# Altium schematic sheet MCU.SchDoc
size A3
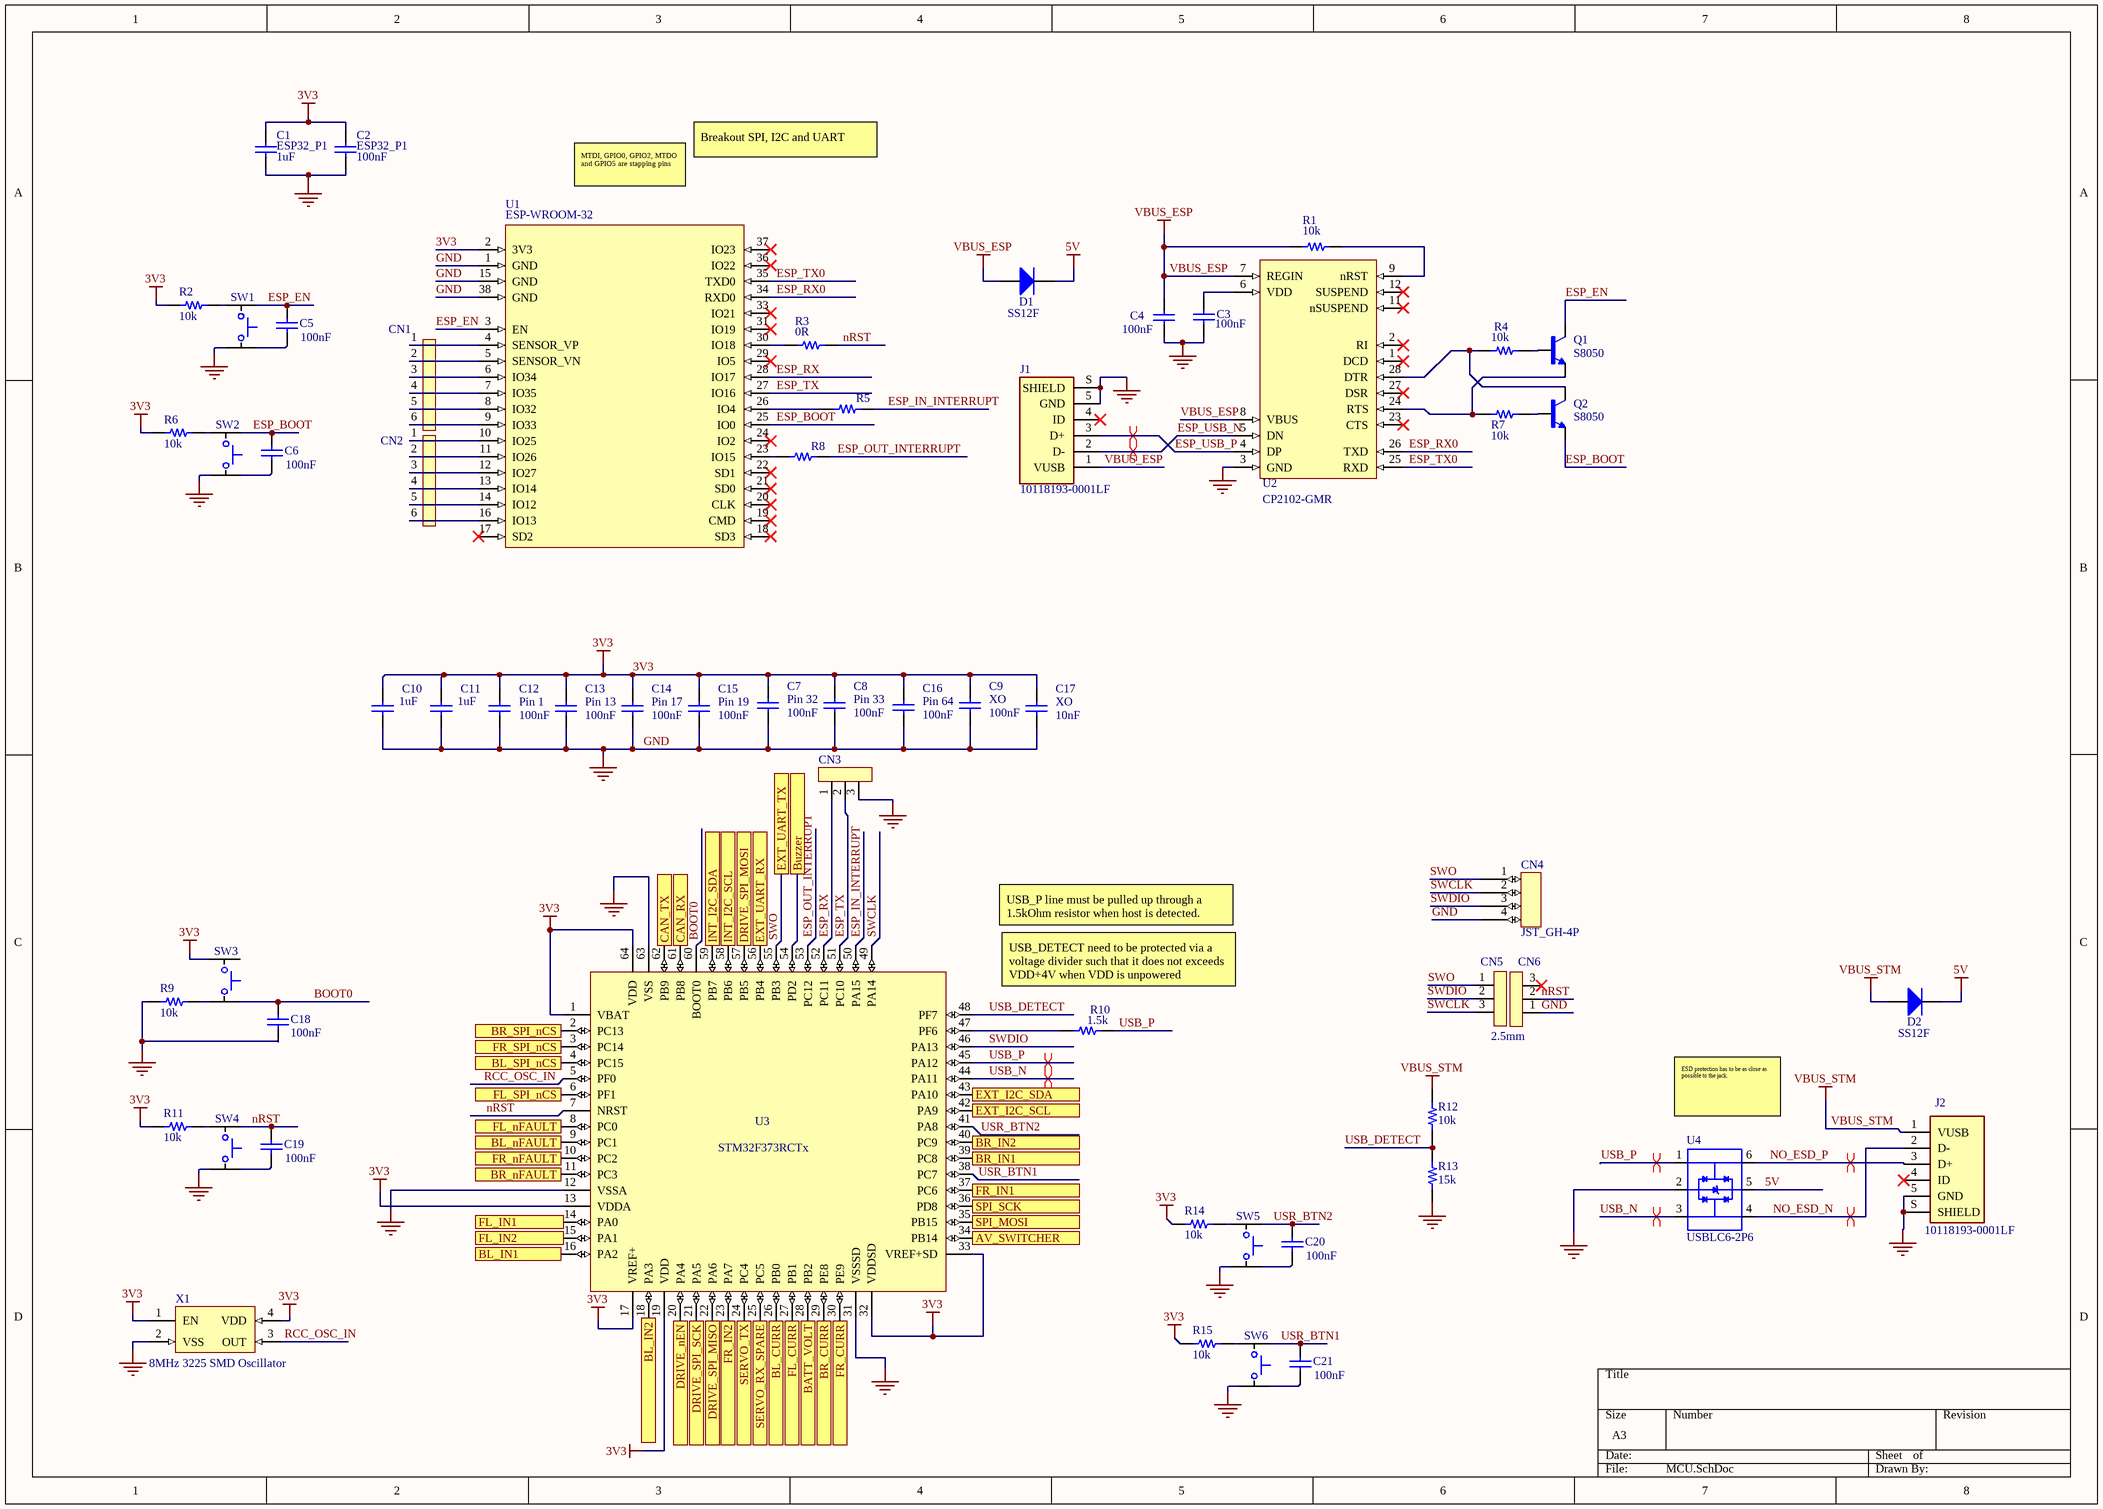
[diagram p0: MCU.SchDoc]

## Parts
C1  ESP32_P1  value 1uF  [0402]
C2  ESP32_P1  value 100nF  [0402]
C3  value 100nF  [0402]  (hidden comment: P6)
C4  value 100nF  [0402]  (hidden comment: P7)
C5  value 100nF  [0402]  (hidden comment: Cap)
C6  value 100nF  [0402]  (hidden comment: Cap)
C7  Pin 32  value 100nF  [0402]
C8  Pin 33  value 100nF  [0402]
C9  XO  value 100nF  [0402]
C10  value 1uF  [0402]
C11  value 1uF  [0402]
C12  Pin 1  value 100nF  [0402]
C13  Pin 13  value 100nF  [0402]
C14  Pin 17  value 100nF  [0402]
C15  Pin 19  value 100nF  [0402]
C16  Pin 64  value 100nF  [0402]
C17  XO  value 10nF  [0402]
C18  value 100nF  [0402]  (hidden comment: Cap)
C19  value 100nF  [0402]  (hidden comment: Cap)
C20  value 100nF  [0402]  (hidden comment: Cap)
C21  value 100nF  [0402]  (hidden comment: Cap)
CN1  6P-2.5mm  [6-Pin-Header]  (value not drawn)
CN2  6P-2.5mm  [6-Pin-Header]  (value not drawn)
CN3  3P-2.5mm  [2.5mm-3P]  (value not drawn)
CN4  JST_GH-4P  [JST_GH-4P]
CN5  2.5mm  [2.5mm-3P]
CN6  3P-2.5mm  [2.5mm-3P]  (value not drawn)
D1  SS12F  [SMAF_DIODE]
D2  SS12F  [SMAF_DIODE]
J1  10118193-0001LF  [FCI_10118193-0001LF]
J2  10118193-0001LF  [FCI_10118193-0001LF]
Q1  S8050  [SOT23-FET]
Q2  S8050  [SOT23-FET]
R1  10k  [0805 - duplicate]
R2  10k  [0805 - duplicate]
R3  0R  [0805 - duplicate]
R4  10k  [0805 - duplicate]
R5  1k  [0805 - duplicate]  (value not drawn)
R6  10k  [0805 - duplicate]
R7  10k  [0805 - duplicate]
R8  1k  [0805 - duplicate]  (value not drawn)
R9  10k  [0805 - duplicate]
R10  1.5k  [0805 - duplicate]
R11  10k  [0805 - duplicate]
R12  10k  [2010_SMD_Resistor]
R13  15k  [2010_SMD_Resistor]
R14  10k  [0805 - duplicate]
R15  10k  [0805 - duplicate]
SW1  SPST Switch  [4.8x4.8-SMD-SWITCH]  (value not drawn)
SW2  SPST Switch  [4.8x4.8-SMD-SWITCH]  (value not drawn)
SW3  SPST Switch  [4.8x4.8-SMD-SWITCH]  (value not drawn)
SW4  SPST Switch  [4.8x4.8-SMD-SWITCH]  (value not drawn)
SW5  USR_BTN2  [4.8x4.8-SMD-SWITCH]  (value not drawn)
SW6  USR_BTN1  [4.8x4.8-SMD-SWITCH]  (value not drawn)
U1  ESP-WROOM-32  [ESP-WROOM-32]
U2  CP2102-GMR  [QFN28G_0.5-5X5MM]
U3  STM32F373RCTx  [LQFP64]
U4  USBLC6-2P6  [SOT50P160X60-6N]
X1  8MHz 3225 SMD Oscillator  [3.2x2.5 SMD]

## Ports
AV_SWITCHER, BATT_VOLT, BL_CURR, BL_IN1, BL_IN2, BL_nFAULT, BL_SPI_nCS, BR_CURR, BR_IN1, BR_IN2, BR_nFAULT, BR_SPI_nCS, Buzzer, CAN_RX, CAN_TX, DRIVE_nEN, DRIVE_SPI_MISO, DRIVE_SPI_MOSI, DRIVE_SPI_SCK, EXT_I2C_SCL, EXT_I2C_SDA, EXT_UART_RX, EXT_UART_TX, FL_CURR, FL_IN1, FL_IN2, FL_nFAULT, FL_SPI_nCS, FR_CURR, FR_IN1, FR_IN2, FR_nFAULT, FR_SPI_nCS, INT_I2C_SCL, INT_I2C_SDA, SERVO_RX_SPARE, SERVO_TX, SPI_MOSI, SPI_SCK

## Nets
3V3: C1.2 C2.2 C7.2 C8.2 C9.2 C10.2 C11.2 C12.2 C13.2 C14.2 C15.2 C16.2 C17.2 R2.1 R6.1 R11.1 R14.1 R15.1 SW3.1 U1.2(3V3) U3.1(VBAT) U3.13(VDDA) U3.17(VREF+) U3.19(VDD) U3.32(VDDSD) U3.33(VREF+SD) U3.64(VDD) X1.1(EN) X1.4(VDD)
5V: D1.2(K) D2.2(K) U4.5(VBUS)
GND: C1.1 C2.1 C3.1 C4.1 C7.1 C8.1 C9.1 C10.1 C11.1 C12.1 C13.1 C14.1 C15.1 C16.1 C17.1 C18.2 CN3.3 CN4.4 CN6.1 J1.5(GND) J1.S(SHIELD) J2.5(GND) J2.S(SHIELD) R9.1 R13.1 SW1.3 SW2.3 SW4.3 SW5.3 SW6.3 U1.1(GND) U1.15(GND) U1.38(GND) U2.3(GND) U3.12(VSSA) U3.31(VSSSD) U3.63(VSS) U4.2(GND) X1.2(VSS)
VBUS_ESP: C4.2 D1.1(A) J1.1(VUSB) R1.1 U2.7(REGIN) U2.8(VBUS)
VBUS_STM: D2.1(A) J2.1(VUSB) R12.2
AV_SWITCHER: U3.34(PB14) ; port AV_SWITCHER
BATT_VOLT: U3.28(PB2) ; port BATT_VOLT
BL_CURR: U3.26(PB0) ; port BL_CURR
BL_IN1: U3.16(PA2) ; port BL_IN1
BL_IN2: U3.18(PA3) ; port BL_IN2
BL_nFAULT: U3.9(PC1) ; port BL_nFAULT
BL_SPI_nCS: U3.4(PC15) ; port BL_SPI_nCS
BOOT0: C18.1 SW3.4 U3.60(BOOT0)
BR_CURR: U3.29(PE8) ; port BR_CURR
BR_IN1: U3.39(PC8) ; port BR_IN1
BR_IN2: U3.40(PC9) ; port BR_IN2
BR_nFAULT: U3.11(PC3) ; port BR_nFAULT
BR_SPI_nCS: U3.2(PC13) ; port BR_SPI_nCS
Buzzer: U3.54(PD2) ; port Buzzer
CAN_RX: U3.61(PB8) ; port CAN_RX
CAN_TX: U3.62(PB9) ; port CAN_TX
DRIVE_nEN: U3.20(PA4) ; port DRIVE_nEN
DRIVE_SPI_MISO: U3.22(PA6) ; port DRIVE_SPI_MISO
DRIVE_SPI_MOSI: U3.57(PB5) ; port DRIVE_SPI_MOSI
DRIVE_SPI_SCK: U3.21(PA5) ; port DRIVE_SPI_SCK
ESP_BOOT: C6.2 Q2.2(E) SW2.2 U1.25(IO0)
ESP_EN: C5.2 Q1.3(C) SW1.2 U1.3(EN)
ESP_IN_INTERRUPT: R5.2 U3.50(PA15)
ESP_OUT_INTERRUPT: R8.2 U3.53(PC12)
ESP_RX: CN3.1 U1.28(IO17) U3.52(PC11)
ESP_RX0: U1.34(RXD0) U2.26(TXD)
ESP_TX: CN3.2 U1.27(IO16) U3.51(PC10)
ESP_TX0: U1.35(TXD0) U2.25(RXD)
ESP_USB_N: J1.2(D-) U2.5(DN)
ESP_USB_P: J1.3(D+) U2.4(DP)
EXT_I2C_SCL: U3.42(PA9) ; port EXT_I2C_SCL
EXT_I2C_SDA: U3.43(PA10) ; port EXT_I2C_SDA
EXT_UART_RX: U3.56(PB4) ; port EXT_UART_RX
FL_CURR: U3.27(PB1) ; port FL_CURR
FL_IN1: U3.14(PA0) ; port FL_IN1
FL_IN2: U3.15(PA1) ; port FL_IN2
FL_nFAULT: U3.8(PC0) ; port FL_nFAULT
FL_SPI_nCS: U3.6(PF1) ; port FL_SPI_nCS
FR_CURR: U3.30(PE9) ; port FR_CURR
FR_IN1: U3.37(PC6) ; port FR_IN1
FR_IN2: U3.23(PA7) ; port FR_IN2
FR_nFAULT: U3.10(PC2) ; port FR_nFAULT
FR_SPI_nCS: U3.3(PC14) ; port FR_SPI_nCS
INT_I2C_SCL: U3.58(PB6) ; port INT_I2C_SCL
INT_I2C_SDA: U3.59(PB7) ; port INT_I2C_SDA
NO_ESD_N: J2.2(D-) U4.4(I/O2_2)
NO_ESD_P: J2.3(D+) U4.6(I/O1_2)
nRST: C19.2 CN6.2 R3.2 SW4.2 U3.7(NRST)
RCC_OSC_IN: U3.5(PF0) X1.3(OUT)
SERVO_RX_SPARE: U3.25(PC5) ; port SERVO_RX_SPARE
SERVO_TX: U3.24(PC4) ; port SERVO_TX
SPI_MOSI: U3.35(PB15) ; port SPI_MOSI
SPI_SCK: U3.36(PD8) ; port SPI_SCK
SWCLK: CN4.2 CN5.3 U3.49(PA14)
SWDIO: CN4.3 CN5.2 U3.46(PA13)
SWO: CN4.1 CN5.1 U3.55(PB3) ; port EXT_UART_TX
USB_DETECT: R12.1 R13.2 U3.48(PF7)
USB_N: U3.44(PA11) U4.3(I/O2_1)
USB_P: R10.2 U3.45(PA12) U4.1(I/O1_1)
USR_BTN1: C21.2 SW6.2 U3.38(PC7)
USR_BTN2: C20.2 SW5.2 U3.41(PA8)
NetC3_2: C3.2 U2.6(VDD)
NetC5_1: C5.1 SW1.4
NetC6_1: C6.1 SW2.4
NetC19_1: C19.1 SW4.4
NetC20_1: C20.1 SW5.4
NetC21_1: C21.1 SW6.4
NetCN1_1: CN1.1 U1.4(SENSOR_VP)
NetCN1_2: CN1.2 U1.5(SENSOR_VN)
NetCN1_3: CN1.3 U1.6(IO34)
NetCN1_4: CN1.4 U1.7(IO35)
NetCN1_5: CN1.5 U1.8(IO32)
NetCN1_6: CN1.6 U1.9(IO33)
NetCN2_1: CN2.1 U1.10(IO25)
NetCN2_2: CN2.2 U1.11(IO26)
NetCN2_3: CN2.3 U1.12(IO27)
NetCN2_4: CN2.4 U1.13(IO14)
NetCN2_5: CN2.5 U1.14(IO12)
NetCN2_6: CN2.6 U1.16(IO13)
NetQ1_1: Q1.1(B) R4.2
NetQ1_2: Q1.2(E) R7.1 U2.24(RTS)
NetQ2_1: Q2.1(B) R7.2
NetQ2_3: Q2.3(C) R4.1 U2.28(DTR)
NetR1_2: R1.2 U2.9(nRST)
NetR2_2: R2.2 SW1.1
NetR3_1: R3.1 U1.30(IO18)
NetR5_1: R5.1 U1.26(IO4)
NetR6_2: R6.2 SW2.1
NetR8_1: R8.1 U1.23(IO15)
NetR9_2: R9.2 SW3.3
NetR10_1: R10.1 U3.47(PF6)
NetR11_2: R11.2 SW4.1
NetR14_2: R14.2 SW5.1
NetR15_2: R15.2 SW6.1

Not connected (* = marked no-connect by the designer): CN6 3*; J1 4(ID)*; J2 4(ID)*; SW3 2; U1 17(SD2)* 18(SD3)* 19(CMD)* 20(CLK)* 21(SD0)* 22(SD1)* 24(IO2)* 29(IO5)* 31(IO19)* 33(IO21)* 36(IO22)* 37(IO23)*; U2 1(DCD)* 2(RI)* 11(nSUSPEND)* 12(SUSPEND)* 23(CTS)* 27(DSR)*

## Layout directives
differential pair: ESP_USB_N, ESP_USB_P, NO_ESD_N, NO_ESD_P, USB_N, USB_P

## Notes on the sheet
- MTDI, GPIO0, GPIO2, MTDO and GPIO5 are stapping pins
- Breakout SPI, I2C and UART
- USB_P line must be pulled up through a 1.5kOhm resistor when host is detected.
- USB_DETECT need to be protected via a voltage divider such that it does not exceeds VDD+4V when VDD is unpowered
- (near U4) ESD protection has to be as close as possible to the jack.

## Library data of the parts
C1-C4 C7-C17 = Cap: Published: 8-Jun-2000; LatestRevisionDate: 17-Jul-2002; LatestRevisionNote: Re-released for DXP Platform.; PackageReference: RAD-0.3; Publisher: Altium Limited; PackageDescription: Radial Cap, Thru-Hole; 2 Leads; 0.3 in Pin Spacing
CN5 = 3P-2.5mm
J1 J2 = 10118193-0001LF: USB - micro B USB 2.0 Receptacle Connector 5 Position Surface Mount, Right Angle; Through Hole; MF: Amphenol ICC; Availability: Unavailable; SnapEDA_Link: https://www.snapeda.com/parts/10118193-0001LF/Amphenol%20FCI/view-part/2758989/?ref=snap; MP: 10118193-0001LF; Price: None; Value: *; Package: None
Q1 Q2 = S8050: MF: MICROSS/On Semiconductor; MP: 2N2222; Value: *; Package: TO-18-3 NJS; Digi-Key_Purchase_URL: https://www.digikey.com.mx/product-detail/en/microsemi-corporation/JANS2N2222A/1086-15156-ND/4384334?utm_source=snapeda&utm_medium=aggregator&utm_campaign=symbol; SnapEDA_Link: https://www.snapeda.com/parts/2N2222/MICROSS/On%20Semiconductor/view-part/561967/?ref=snap; Digi-Key_Part_Number: 1086-15156-ND
R1-R15 = Resistor
SW5 SW6 = SPST Switch
U1 = ESP-WROOM-32: WiFi 802.11b/g/n/d/e/i Transceiver Module 2.4GHz Surface Mount; MF: Olimex LTD; SnapEDA_Link: https://www.snapeda.com/parts/ESP-WROOM-32/Olimex%20LTD/view-part/2311927/?ref=snap; Package: Module Olimex LTD; MP: ESP-WROOM-32; Availability: Unavailable; Price: None; Value: *
U4 = USBLC6-2P6: 17V Clamp 5A _8/20µs_ Ipp Tvs Diode Surface Mount SOT-666; MF: STMicroelectronics; Value: *; MP: USBLC6-2P6; SnapEDA_Link: https://www.snapeda.com/parts/USBLC6-2P6/STMicroelectronics/view-part/106846/?ref=snap; Availability: Unavailable; Price: None; Package: SOT-563 STMicroelectronics
C5 C6 C18-C21 = Cap: Published: 8-Jun-2000; LatestRevisionDate: 17-Jul-2002; LatestRevisionNote: Re-released for DXP Platform.; PackageReference: RAD-0.3; Publisher: Altium Limited; PackageDescription: Radial Cap, Thru-Hole; 2 Leads; 0.3 in Pin Spacing